# Altium schematic sheet S7CAS-PLEIADES-CARTE-MERE_P07_HIGH_POWER.SchDoc
size Tabloid; DocumentNumber: 2; SheetNumber: 2; SheetTotal: 16; Sheet_Name: HIGH POWER VALUES; Size: 11x17
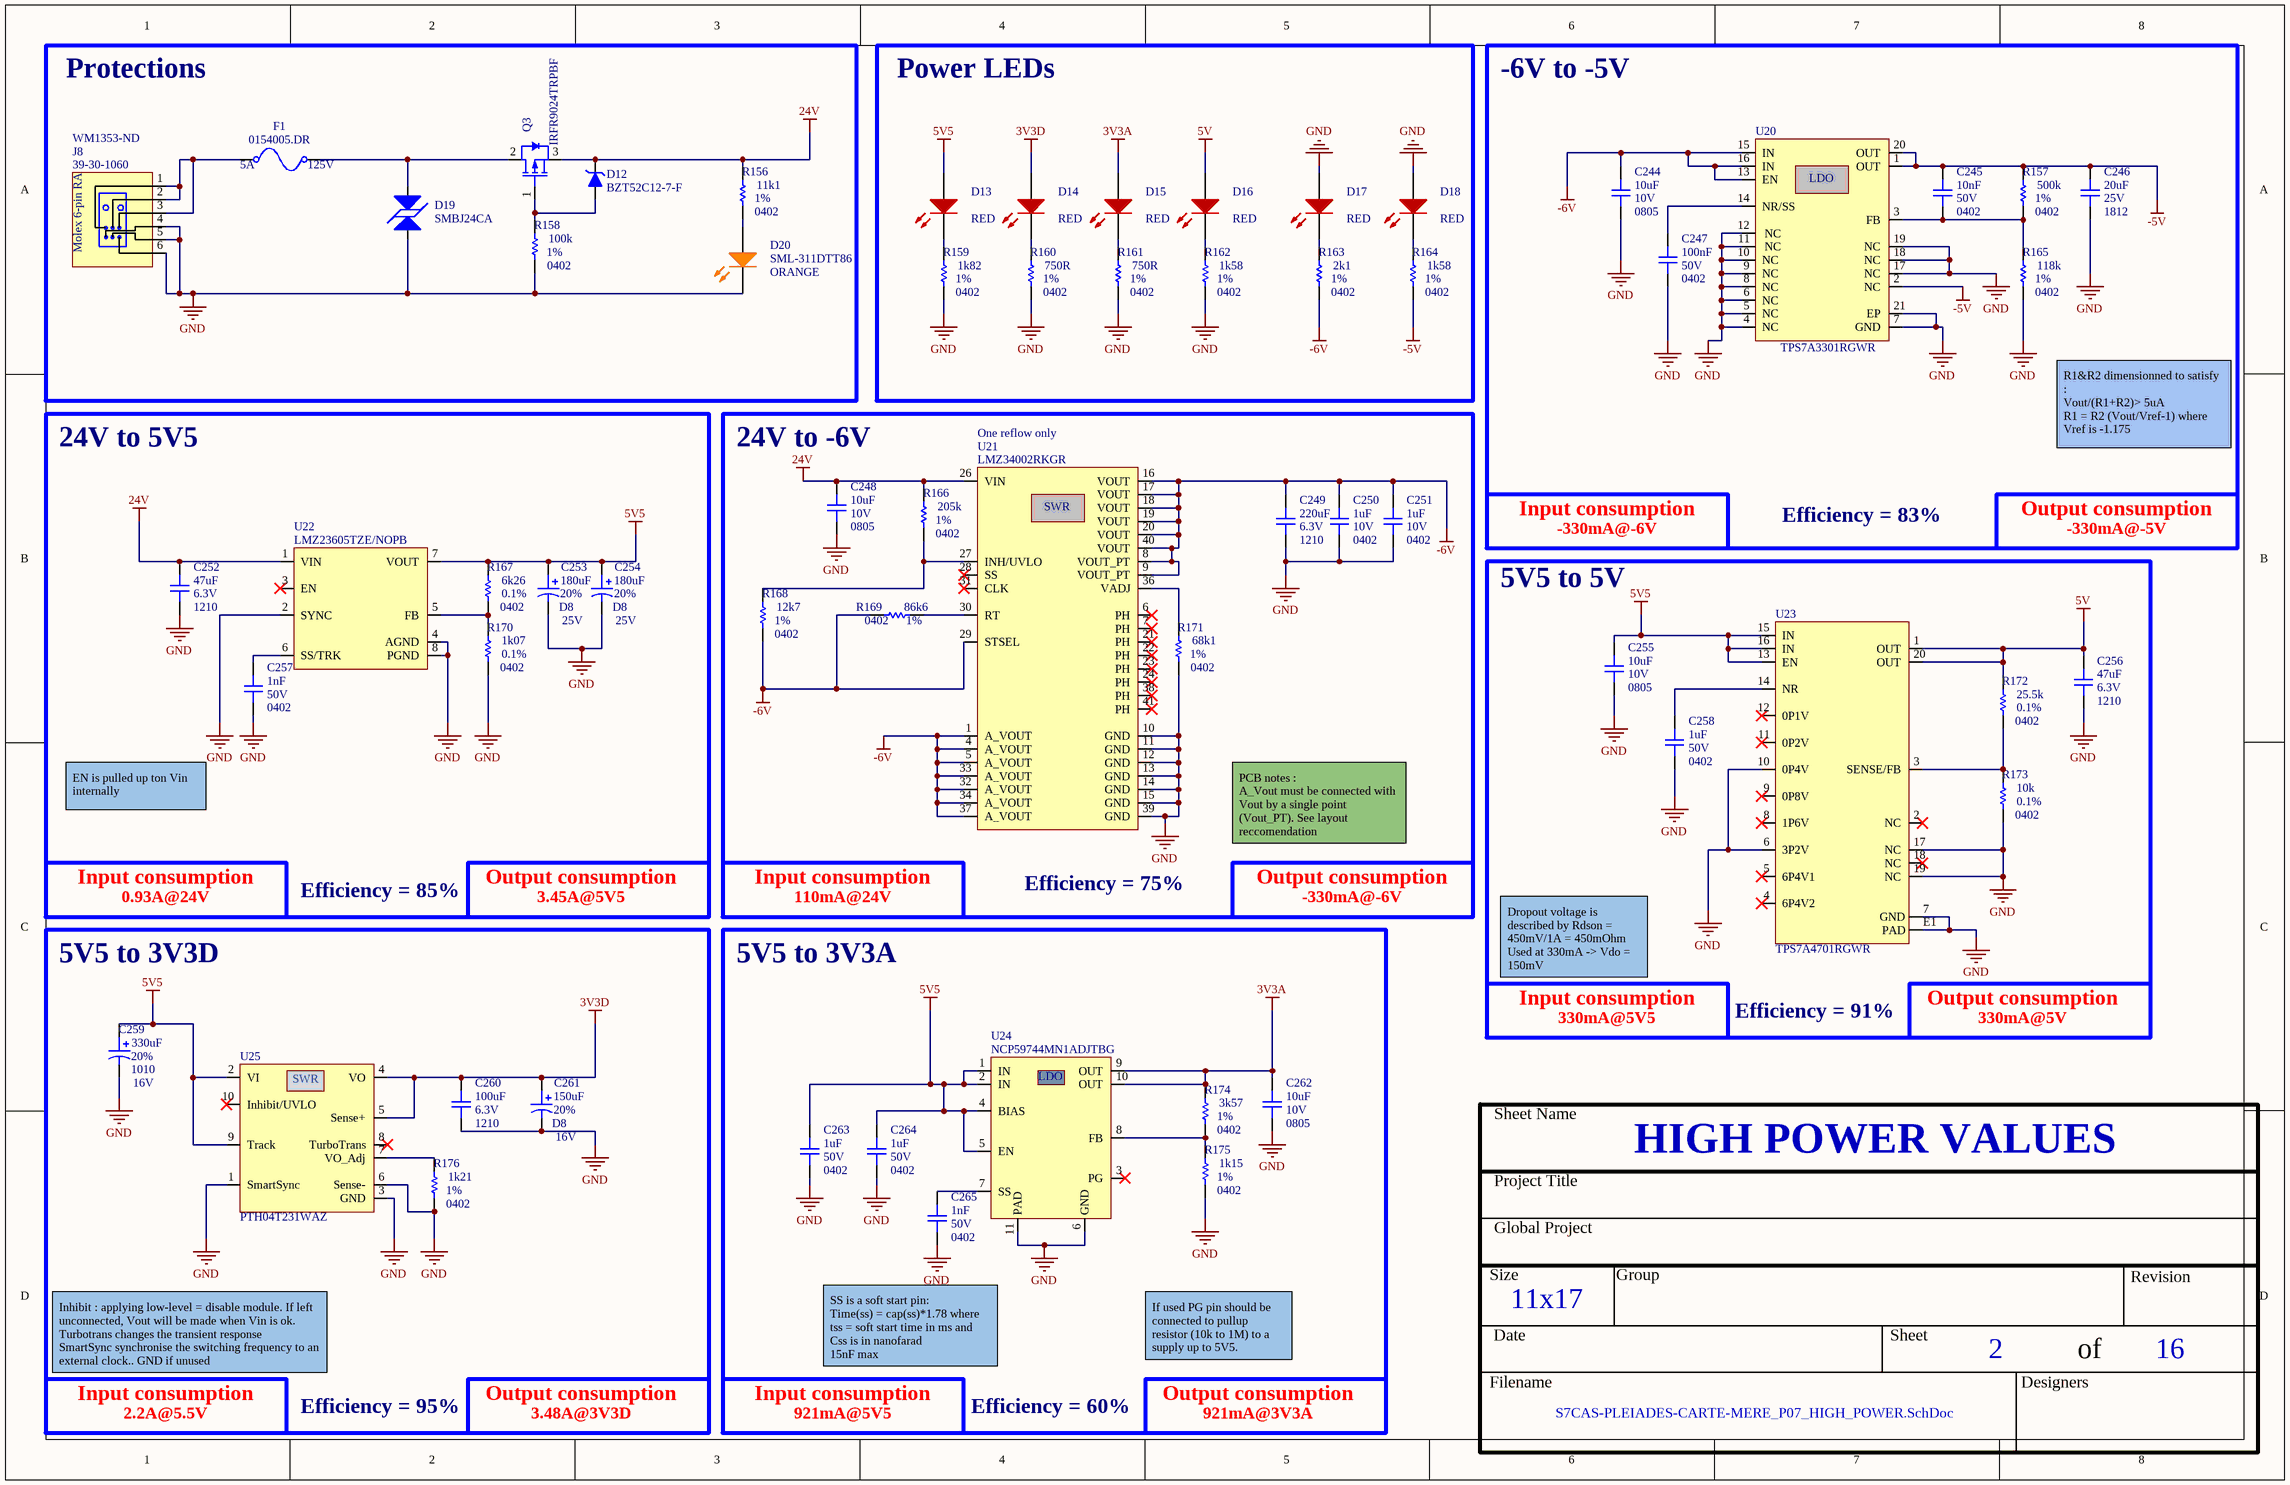
[diagram p0: S7CAS-PLEIADES-CARTE-MERE_P07_HIGH_POWER.SchDoc]

## Parts
C244  value 10uF  Voltage: 10V  Package: 0805  [CAP_0805]  (hidden comment: CAP - 0805)
C245  value 10nF  Voltage: 50V  Package: 0402  [CAP_0402]  (hidden comment: CAP - 0402)
C246  value 20uF  Voltage: 25V  Package: 1812  [CAP_1812]  (hidden comment: CAP - 1812)
C247  value 100nF  Voltage: 50V  Package: 0402  [CAP_0402]  (hidden comment: CAP - 0402)
C248  value 10uF  Voltage: 10V  Package: 0805  [CAP_0805]  (hidden comment: CAP - 0805)
C249  value 220uF  Voltage: 6.3V  Package: 1210  [CAP_1210]  (hidden comment: CAP - 1210)
C250  value 1uF  Voltage: 10V  Package: 0402  [CAP_0402]  (hidden comment: CAP - 0402)
C251  value 1uF  Voltage: 10V  Package: 0402  [CAP_0402]  (hidden comment: CAP - 0402)
C252  value 47uF  Voltage: 6.3V  Package: 1210  [CAP_1210]  (hidden comment: CAP - 1210)
C253  value 180uF  Voltage: 25V  Package: D8  Precision: 20%  [CAP_ALU_D8]  (hidden comment: EEE-FNE181XUP)
C254  value 180uF  Voltage: 25V  Package: D8  Precision: 20%  [CAP_ALU_D8]  (hidden comment: EEE-FNE181XUP)
C255  value 10uF  Voltage: 10V  Package: 0805  [CAP_0805]  (hidden comment: CAP - 0805)
C256  value 47uF  Voltage: 6.3V  Package: 1210  [CAP_1210]  (hidden comment: CAP - 1210)
C257  value 1nF  Voltage: 50V  Package: 0402  [CAP_0402]  (hidden comment: CAP - 0402)
C258  value 1uF  Voltage: 50V  Package: 0402  [CAP_0402]  (hidden comment: CAP - 0402)
C259  value 330uF  Voltage: 16V  Package: 1010  Precision: 20%  [CAP_ALU_1010_vishay]  (hidden comment: MAL214699501E3)
C260  value 100uF  Voltage: 6.3V  Package: 1210  [CAP_1210]  (hidden comment: CAP - 1210)
C261  value 150uF  Voltage: 16V  Package: D8  Precision: 20%  [CAP_ALU_D8]  (hidden comment: EEE-FKC151XAP)
C262  value 10uF  Voltage: 10V  Package: 0805  [CAP_0805]  (hidden comment: CAP - 0805)
C263  value 1uF  Voltage: 50V  Package: 0402  [CAP_0402]  (hidden comment: CAP - 0402)
C264  value 1uF  Voltage: 50V  Package: 0402  [CAP_0402]  (hidden comment: CAP - 0402)
C265  value 1nF  Voltage: 50V  Package: 0402  [CAP_0402]  (hidden comment: CAP - 0402)
D12  BZT52C12-7-F  [SOD123_DIO]
D13  value RED  [LED_0603]  (hidden comment: SML-311UTT86)
D14  value RED  [LED_0603]  (hidden comment: SML-311UTT86)
D15  value RED  [LED_0603]  (hidden comment: SML-311UTT86)
D16  value RED  [LED_0603]  (hidden comment: SML-311UTT86)
D17  value RED  [LED_0603]  (hidden comment: SML-311UTT86)
D18  value RED  [LED_0603]  (hidden comment: SML-311UTT86)
D19  SMBJ24CA  [TVS_PWR_SMBJ36CA]
D20  SML-311DTT86  value ORANGE  [LED_0603]
F1  0154005.DR  Voltage Rating: 125V  Current Rating: 5A  [FUS_0154XXX.DR]
J8  39-30-1060  Supplier Part Number 1: WM1353-ND  [CONN_MOL_39-30-1060]
Q3  IRFR9024TRPBF  [TRX_PMOS_IRFR9024TRPBF]
R156  value 11k1  Package: 0402  Precision: 1%  [RES_0402]  (hidden comment: RES - 0402)
R157  value 500k  Package: 0402  Precision: 1%  [RES_0402]  (hidden comment: RES - 0402)
R158  value 100k  Package: 0402  Precision: 1%  [RES_0402]  (hidden comment: RES - 0402)
R159  value 1k82  Package: 0402  Precision: 1%  [RES_0402]  (hidden comment: RES - 0402)
R160  value 750R  Package: 0402  Precision: 1%  [RES_0402]  (hidden comment: RES - 0402)
R161  value 750R  Package: 0402  Precision: 1%  [RES_0402]  (hidden comment: RES - 0402)
R162  value 1k58  Package: 0402  Precision: 1%  [RES_0402]  (hidden comment: RES - 0402)
R163  value 2k1  Package: 0402  Precision: 1%  [RES_0402]  (hidden comment: RES - 0402)
R164  value 1k58  Package: 0402  Precision: 1%  [RES_0402]  (hidden comment: RES - 0402)
R165  value 118k  Package: 0402  Precision: 1%  [RES_0402]  (hidden comment: RES - 0402)
R166  value 205k  Package: 0402  Precision: 1%  [RES_0402]  (hidden comment: RES - 0402)
R167  value 6k26  Package: 0402  Precision: 0.1%  [RES_0402]  (hidden comment: RES - 0402)
R168  value 12k7  Package: 0402  Precision: 1%  [RES_0402]  (hidden comment: RES - 0402)
R169  value 86k6  Package: 0402  Precision: 1%  [RES_0402]  (hidden comment: RES - 0402)
R170  value 1k07  Package: 0402  Precision: 0.1%  [RES_0402]  (hidden comment: RES - 0402)
R171  value 68k1  Package: 0402  Precision: 1%  [RES_0402]  (hidden comment: RES - 0402)
R172  value 25.5k  Package: 0402  Precision: 0.1%  [RES_0402]  (hidden comment: RES - 0402)
R173  value 10k  Package: 0402  Precision: 0.1%  [RES_0402]  (hidden comment: RES - 0402)
R174  value 3k57  Package: 0402  Precision: 1%  [RES_0402]  (hidden comment: RES - 0402)
R175  value 1k15  Package: 0402  Precision: 1%  [RES_0402]  (hidden comment: RES - 0402)
R176  value 1k21  Package: 0402  Precision: 1%  [RES_0402]  (hidden comment: RES - 0402)
U20  TPS7A3301RGWR  [REG_LDO_TPS7A3301RGWR]
U21  LMZ34002RKGR  Assembly Note: One reflow only  [REG_SWR_LMZ34002RKGR]
U22  LMZ23605TZE/NOPB  [REG_SWR_LMZ23605TZE/NOPB]
U23  TPS7A4701RGWR  [REG_TPS7A4701RGWR]
U24  NCP59744MN1ADJTBG  [REG_LDO_NCP59744MN1ADJTBG]
U25  PTH04T231WAZ  [REG_SWR_PTH04T231WAZ]

## Blocks framed on the sheet
Protections: D12 D19 D20 F1 J8 Q3 R156 R158
Power LEDs: D13-D18 R159-R164
-6V to -5V: C244-C247 R157 R165 U20
24V to 5V5: C252-C254 C257 R167 R170 U22
24V to -6V: C248-C251 R166 R168 R169 R171 U21
5V5 to 5V: C255 C256 C258 R172 R173 U23
5V5 to 3V3D: C259-C261 R176 U25
5V5 to 3V3A: C262-C265 R174 R175 U24

## Nets
3V3A: C262.2 D15.A R174.2 U24.9(OUT) U24.10(OUT)
3V3D: C260.2 C261.1 D14.A U25.4(VO) U25.5(Sense+)
5V: C256.2 D16.A R172.2 U23.1(OUT) U23.20(OUT)
5V5: C253.1 C254.1 C255.2 C259.1 C263.2 C264.2 D13.A R167.2 U22.7(VOUT) U23.13(EN) U23.15(IN) U23.16(IN) U24.1(IN) U24.2(IN) U24.4(BIAS) U24.5(EN) U25.2(VI) U25.9(Track)
24V: C248.2 C252.2 D12.1 Q3.3(D) R156.2 R166.2 U21.26(VIN) U22.1(VIN)
-5V: C245.2 C246.2 R157.2 R164.1 U20.1(OUT) U20.2(NC) U20.20(OUT)
-6V: C244.2 C249.2 C250.2 C251.2 R163.1 R168.1 R169.1 U20.13(EN) U20.15(IN) U20.16(IN) U21.1(A_VOUT) U21.4(A_VOUT) U21.5(A_VOUT) U21.8(VOUT_PT) U21.9(VOUT_PT) U21.16(VOUT) U21.17(VOUT) U21.18(VOUT) U21.19(VOUT) U21.20(VOUT) U21.29(STSEL) U21.32(A_VOUT) U21.33(A_VOUT) U21.34(A_VOUT) U21.37(A_VOUT) U21.40(VOUT)
GND: C244.1 C246.1 C247.1 C248.1 C249.1 C250.1 C251.1 C252.1 C253.2 C254.2 C255.1 C256.1 C257.1 C258.1 C259.2 C260.1 C261.2 C262.1 C263.1 C264.1 C265.1 D17.A D18.A D19.2 D20.K J8.4 J8.5 J8.6 R158.1 R159.1 R160.1 R161.1 R162.1 R165.1 R170.1 R171.1 R173.1 R175.1 R176.1 U20.4(NC) U20.5(NC) U20.6(NC) U20.7(GND) U20.8(NC) U20.9(NC) U20.10(NC) U20.11(NC) U20.12(NC) U20.17(NC) U20.18(NC) U20.19(NC) U20.21(EP) U21.10(GND) U21.11(GND) U21.12(GND) U21.13(GND) U21.14(GND) U21.15(GND) U21.39(GND) U22.2(SYNC) U22.4(AGND) U22.8(PGND) U23.6(3P2V) U23.7(GND) U23.10(0P4V) U23.17(NC) U23.19(NC) U23.E1(PAD) U24.6(GND) U24.11(PAD) U25.1(SmartSync) U25.3(GND) U25.6(Sense-)
NetC245_1: C245.1 R157.1 R165.2 U20.3(FB)
NetC247_2: C247.2 U20.14(NR/SS)
NetC257_2: C257.2 U22.6(SS/TRK)
NetC258_2: C258.2 U23.14(NR)
NetC265_2: C265.2 U24.7(SS)
NetD12_2: D12.2 Q3.1(G) R158.2
NetD13_K: D13.K R159.2
NetD14_K: D14.K R160.2
NetD15_K: D15.K R161.2
NetD16_K: D16.K R162.2
NetD17_K: D17.K R163.2
NetD18_K: D18.K R164.2
NetD19_1: D19.1 F1.2 Q3.2(S)
NetD20_A: D20.A R156.1
NetF1_1: F1.1 J8.1 J8.2 J8.3
NetR166_1: R166.1 R168.2 U21.27(INH/UVLO)
NetR167_1: R167.1 R170.2 U22.5(FB)
NetR169_2: R169.2 U21.30(RT)
NetR171_2: R171.2 U21.36(VADJ)
NetR172_1: R172.1 R173.2 U23.3(SENSE/FB)
NetR174_1: R174.1 R175.2 U24.8(FB)
NetR176_2: R176.2 U25.7(VO_Adj)

Not connected (* = marked no-connect by the designer): U21 2(DNC) 3(DNC) 6(PH)* 7(PH)* 21(PH)* 22(PH)* 23(PH)* 24(PH)* 25(DNC) 28(SS)* 31(CLK)* 35(DNC) 38(PH)* 41(PH)*; U22 3(EN)*; U23 2(NC)* 4(6P4V2)* 5(6P4V1)* 8(1P6V)* 9(0P8V)* 11(0P2V)* 12(0P1V)* 18(NC)*; U24 3(PG)*; U25 8(TurboTrans)* 10(Inhibit/UVLO)*

## Notes on the sheet
- R1&R2 dimensionned to satisfy :
  Vout/(R1+R2)> 5uA
  R1 = R2 (Vout/Vref-1) where Vref is -1.175
- -330mA@-6V
- Input consumption
- Efficiency = 83%
- -330mA@-5V
- Output consumption
- EN is pulled up ton Vin internally
- PCB notes :
  A_Vout must be connected with Vout by a single point (Vout_PT). See layout reccomendation
- 0.93A@24V
- Efficiency = 85%
- 3.45A@5V5
- 110mA@24V
- Efficiency = 75%
- Dropout voltage is described by Rdson = 450mV/1A = 450mOhm
  Used at 330mA -> Vdo = 150mV
- 330mA@5V5
- Efficiency = 91%
- 330mA@5V
- Inhibit : applying low-level = disable module. If left unconnected, Vout will be made when Vin is ok.
  Turbotrans changes the transient response
  SmartSync synchronise the switching frequency to an external clock.. GND if unused
- SS is a soft start pin:
  Time(ss) = cap(ss)*1.78 where tss = soft start time in ms and Css is in nanofarad
  15nF max
- If used PG pin should be connected to pullup resistor (10k to 1M) to a supply up to 5V5.
- 2.2A@5.5V
- Efficiency = 95%
- 3.48A@3V3D
- 921mA@5V5
- Efficiency = 60%
- 921mA@3V3A
- Sheet Name
- Project Title
- Global Project
- Size
- Group
- Revision
- Date
- Sheet
- of
- Filename
- Designers
- (in symbol CONN_MOL_39-30-1060) Molex 6-pin RA
- (in symbol REG_LDO_NCP59744MN1ADJTBG) LDO
- (in symbol REG_LDO_TPS7A3301RGWR) LDO
- (in symbol REG_SWR_LMZ34002RKGR) SWR
- (in symbol REG_SWR_PTH04T231WAZ) SWR

## Library data of the parts
C244 C248 C255 C262 = CAP - 0805: Mfg: CL21B106KPQNNNE; Precision: 10%; Current: *; CreatedBy: Jonathan Bouchard; Power: *
C245 C247 C250 C251 = CAP - 0402: Precision: 10%; Current: *; CreatedBy: Jonathan Bouchard; Power: *
C246 = CAP - 1812: Precision: 10%; Current: *; CreatedBy: Jonathan Bouchard; Power: *
C249 = CAP - 1210: Mfg Part Number: GRM32ER60J227ME05L; Precision: 10%; Current: *; CreatedBy: Jonathan Bouchard; Power: *
C252 C256 C260 = CAP - 1210: Precision: 10%; Current: *; CreatedBy: Jonathan Bouchard; Power: *
C253 C254 = CAP_ALU_EEE-FNE181XUP: CAP ALUM 180UF 25VDC 20% SMD; Current: 1.3A; CreatedBy: Philippe; Temperature: -55°C ~ 105°C; Power: *; Supplier 1: Allied Electronics; Supplier Part Number 1: 71942218
C257 C258 C263-C265 = CAP - 0402: Mfg: C1005X7R1H102K050BA; Precision: 10%; Current: *; CreatedBy: Jonathan Bouchard; Power: *
C259 = CAP_ALU_MAL214699501E3: CAP - ALU 330uF 20% 16V - 1010; Current: 750mA; Mfg: Vishay Dale; Mfg Part Number: MAL214699501E3; HelpURL: http://www.vishay.com/docs/28403/146cti.pdf; CreatedBy: Jonathan Bouchard; Temperature: -55°C to 125°C; Power: *; Supplier 1: Digikey; Supplier Part Number 1: 4405PHCT-ND
C261 = CAP_ALU_EEH-ZS1H151P: CAP ALUM 150UF 20% 16V SMD; Current: 1.3A; CreatedBy: Philippe; Temperature: -55°C ~ 105°C; Power: *; Supplier 1: Digi-Key; Supplier Part Number 1: PCE4401CT-ND
D12 = DIO_ZEN_BZT52C12-7-F: Zener Diode 12V 500mW ±5% Surface Mount SOD-123; Vendor: Diodes Inc; Built_By: EMA_UL_Team; SourceLibrary: DiodesInc_2015-05-08; Type: DEV; Manufacturer_Part_Number: BZT52C12-7-F; Copyright: Copyright (C) 2018 Accelerated Designs. All rights reserved; RefDes: RefDes
D13-D18 = LED_SML-311UTT86: LED - 620nM RED 2mA - 0603; Voltage: 1.8V; Mfg: ROHM Semiconductor; Power: 44mW; Current: 2mA; HelpURL: http://media.digikey.com/pdf/Data%20Sheets/Rohm%20PDFs/SML-311%20Series.pdf; CreatedBy: Jonathan Bouchard; Temperature: -30°C to 85°C; Package: 0603; Precision: *; Mfg Part Number: SML-311UTT86; Supplier 1: Digikey; Supplier Part Number 1: 511-1304-1-ND
D19 = TVS_PWR_SMBJ24CA: TVS - 24V 26.7V 600W - DO214AA; Manufacturer #1: Littelfuse Inc.; Value: Vbr = 26.7V -  Clamp = 38.9V; Voltage Rating: 24V Standoff; Current Rating: 15.5A; GRAMS Lib Spec: 2.8; Magnetic Material: UNKNOWN; Polarized: NO; Tolerance: *; Power Max: 600W; HelpURL: http://www.littelfuse.com/~/media/electronics/datasheets/tvs_diodes/littelfuse_tvs_diode_smbj_datasheet.pdf.pdf; CreatedBy/Date: Arnaud Samson - 06/07/18; VerifiedBy: Jonathan Bouchard - 2018-07-13; Temperature: -65°C ~ 150°C (TJ); Package: DO214AA; Manufacturer #2: *; Note: *; Assembly Type: SMD; Part Number #2: *; Part Number #1: SMBJ24CA; Supplier 1: Digi-Key; Supplier Part Number 1: SMBJ24CALFCT-ND; Cryo: UNKNOWN
D20 = LED_SML-311DTT86: LED - 611nM ORANGE 2mA - 0603; Voltage: 1.8V; Mfg: ROHM Semiconductor; Power: 44mW; Current: 2mA; HelpURL: http://media.digikey.com/pdf/Data%20Sheets/Rohm%20PDFs/SML-311%20Series.pdf; CreatedBy: Jonathan Bouchard; Temperature: -40°C to 85°C; Package: 0603; Precision: *; Mfg Part Number: SML-311DTT86; Supplier 1: Digikey; Supplier Part Number 1: 511-1303-1-ND
F1 = FUS_0154005.DR: FUS - 5 A 125 VAC/VDC - 2-SMD; Manufacturer #1: Littelfuse Inc.; Value: 5A 125V AC/DC FAST; GRAMS Lib Spec: 2.8; Magnetic Material: UNKNOWN; Polarized: NO; Tolerance: *; Power Max: *; HelpURL: http://www.littelfuse.com/~/media/electronics/datasheets/fuses/littelfuse_fuse_154_154t_154l_154tl_datasheet.pdf.pdf; CreatedBy/Date: Arnaud Samson - 06/07/18; VerifiedBy: Jonathan Bouchard 2018-07-16; Temperature: -55°C ~ 125°C; Package: 2-SMD; Manufacturer #2: *; Note: *; Assembly Type: SMD; Part Number #2: *; Part Number #1: 0154005.DR; Supplier 1: Digi-Key; Supplier Part Number 1: F1228CT-ND; Cryo: UNKNOWN
J8 = CONN_MOL_39-30-1060: CONN - MOLEX 6 PIN RA; Voltage: *; Current: *; Power: *; Mfg: Molex; Mfg Part Number: 39-30-1060; HelpURL: https://www.molex.com/pdm_docs/sd/039301060_sd.pdf; CreatedBy: Philippe Arsenault / 2021-01-31; Temperature: -30°C ~ 105°C; Value: *; Precision: *; Package: TH-6; Supplier 1: Digi-Key
Q3 = TRX_PMOS_IRFR9024TRPBF: TRX - MOSFET P-CH 60V 8.8A - Surface Mount D-Pak; Manufacturer #1: Vishay Siliconix; Power Max: 2.5W (Ta), 42W (Tc); Voltage rating: 60V (Vds max), 4V (Vgs @ 250uA); Polarized: Yes; Magnetic Material: UNKNOWN; GRAMS Lib Spec: 2.8c; Current Rating: 8.8A; Manufacturer #2: *; Value: *; Part Number #1: IRFR9024TRPBF; Part Number #2: *; HelpURL: https://www.vishay.com/docs/91278/sihfr902.pdf; Assembly Type: SMD; Temperature: -55°C ~ 150°C (TJ); Package: D-Pak; CreatedBy/Date: Philippe Arsenault / 2021-01-31; Tolerance: *; Cryo: UNKNOWN; Supplier 1: Digi-Key; Supplier Part Number 1: IRFR9024PBFCT-ND
R156-R176 = RES - 0402: Voltage: 50V; Power: 1/16W; Current: *; CreatedBy: Jonathan Bouchard
U20 = REG_LDO_TPS7A3301RGWR: REG - LDO Negative Adjustable 1 Output -1.18V-33V 1A -  20-VQFN (5x5); Manufacturer #1: Texas Instruments; Value: -1.18V~-33V; Voltage Rating: -36V; GRAMS Lib Spec: 2.8; Magnetic Material: Unknown; Polarized: Yes; Tolerance: *; Current Rating: 1A; Power Max: *; HelpURL: http://www.ti.com/lit/ds/symlink/tps7a33.pdf; CreatedBy/Date: Keven Deslandes - 2018/10/11; VerifiedBy: Caroline Paulin - 11/12/2018; Temperature: -40°C ~ 125°C; Package: 20-VQFN; Manufacturer #2: *; Assembly Type: SMD; Part Number #2: *; Part Number #1: TPS7A3301RGWR; Supplier 1: Digi-Key; Supplier Part Number 1: 296-39502-1-ND; Cryo: UNKNOWN
U21 = REG_SWR_LMZ34002RKGR: REG - DC DC Converter -3V to -17V 2A - 41-B1QFN; Manufacturer #1: Texas Instruments; Value: -3 ~ -17V; Voltage Rating: 4.5-40V; Power Max: 15W; GRAMS Lib Spec: 2.8c; Magnetic Material: Unknown; Polarized: Yes; Tolerance: *; Current Rating: 2A; HelpURL: http://www.ti.com/lit/ds/symlink/lmz34002.pdf; CreatedBy/Date: P.Marcoux  20-06-2019; VerifiedBy: C.Paulin - 22/01/2020; Temperature: -40°C ~ 85°C; Package: 41-B1QFN; Manufacturer #2: *; Note: *; Assembly Type: SMD; Part Number #2: *; Part Number #1: LMZ34002RKGR; Supplier 1: Digi-Key; Supplier Part Number 1: 296-44356-1-ND; Cryo: UNKNOWN
U22 = REG_SWR_LMZ23605TZE/NOPB: REG - IC BUCK SYNC 36V 5A - TO-PMOD-7; Manufacturer #1: Texas Instruments; Value: 0.8 ~ 6 V; Voltage Rating: 6 ~ 36 V; GRAMS Lib Spec: 2.8; Note: One Reflow; Magnetic Material: YES; Cryo: UNKNOWN; Tolerance: *; Current Rating: 5A; Power Max: *; HelpURL: http://www.ti.com/lit/ds/symlink/lmz23605.pdf; CreatedBy/Date: Arnaud Samson - 05/07/18; VerifiedBy: Jonathan Bouchard 2018-07-13; Temperature: -40°C ~ 125°C; Package: TO-PMOD-7; Manufacturer #2: *; Assembly Type: SMD; Part Number #2: *; Part Number #1: LMZ23605TZE/NOPB; Polarized: YES; Supplier 1: Digi-Key; Supplier Part Number 1: 296-35357-1-ND
U23 = REG_LDO_TPS7A4701RGWR: REG - LINEAR POS ADJ 1A - 20VQFN; Manufacturer #1: Texas Instruments; GRAMS Lib Spec: 2.8; Magnetic Material: Unknown; Polarized: Yes; Value: 1.4 à 34V; Voltage rating: 35V max; Assembly Type: SMD; CreatedBy/Date: L-P Gauthier / 2018-05-29; Current Rating: 1A; Manufacturer #2: TBD; Part Number #1: TPS7A4701RGWR; Part Number #2: TBD; Package: 20-VQFN Exposed Pad; Power Max: *; Tolerance: -; Supplier 1: Digi-Key; Supplier Part Number 1: 296-37224-1-ND; VerifiedBy: Caroline Paulin - 28 sept 2018; Temperature: -40°C ~ 125°C; HelpURL: http://www.ti.com/lit/ds/symlink/tps7a47.pdf; Cryo: UNKNOWN
U24 = REG_LDO_NCP59744MN1ADJTBG: REG - LINEAR POS ADJ 3A BIAS - 10-VFDFN; Manufacturer #1: ON Semiconductor; Value: 0.8V ~ 3.6V; Voltage Rating: (Vout+VDO) ~ 5.5V; Power Max: 10.8W; GRAMS Lib Spec: 2.8; Magnetic Material: Unknown; Polarized: Yes; Tolerance: -; Current Rating: 3A; HelpURL: https://www.onsemi.com/pub/Collateral/NCP59744-D.PDF; CreatedBy/Date: Raphael Bouchard / 2019-06-07; VerifiedBy: C.Paulin - 13/06/2019; Temperature: -40°C ~ 125°C (TJ); Package: 10-VFDFN; Manufacturer #2: -; Note: -; Assembly Type: SMD; Part Number #2: -; Part Number #1: NCP59744MN1ADJTBG; Supplier 1: Digi-Key; Supplier Part Number 1: NCP59744MN1ADJTBGOSCT-ND; Cryo: UNKNOWN
U25 = REG_SWR_PTH04T231WAZ: REG - MODULE PIP 6A 2.2V/5.5V - 10SMD; Manufacturer #1: Texas Instruments; Current Rating: 6A (out); Value: 0.69 - 3.6V (Out); Voltage rating: 2.2-5.5V (Input); Polarized: Yes; Magnetic Material: UNKNOWN; Manufacturer #2: *; Note: *; Power Max: *; Part Number #1: PTH04T231WAZ; Part Number #2: *; HelpURL: http://www.ti.com/lit/ds/symlink/pth04t231w.pdf; Supplier 1: Digi-Key; Assembly Type: SMD; Temperature: -40°C ~ 85°C; Supplier Part Number 1: 296-21792-ND; Package: SMD; CreatedBy/Date: Olivier Bernard / 6/5/2018; VerifiedBy: Caroline Paulin / 10 juillet 2018; Cryo: UNKNOWN